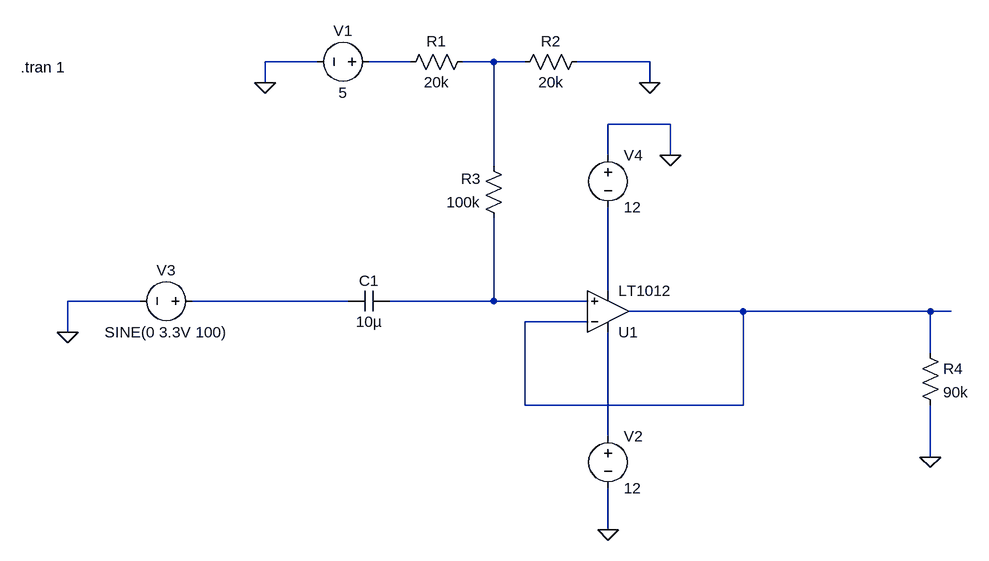
[diagram p0: schematic AudioAmpDiffs.asc]
AudioAmpDiffs.asc, the LTspice schematic file:
Version 4.1
SHEET 1 880 836
WIRE -224 96 -304 96
WIRE -80 96 -144 96
WIRE 48 96 0 96
WIRE 96 96 48 96
WIRE 288 96 176 96
WIRE -304 128 -304 96
WIRE 288 128 288 96
WIRE 320 192 224 192
WIRE 224 240 224 192
WIRE 320 240 320 192
WIRE 48 256 48 96
WIRE 224 448 224 320
WIRE -496 464 -608 464
WIRE -176 464 -416 464
WIRE 48 464 48 336
WIRE 48 464 -112 464
WIRE 192 464 48 464
WIRE 432 480 256 480
WIRE 720 480 432 480
WIRE 752 480 720 480
WIRE 192 496 96 496
WIRE -608 512 -608 464
WIRE 720 544 720 480
WIRE 96 624 96 496
WIRE 432 624 432 480
WIRE 432 624 96 624
WIRE 224 672 224 512
WIRE 720 704 720 624
WIRE 224 816 224 752
FLAG -304 128 0
FLAG 288 128 0
FLAG -608 512 0
FLAG 720 704 0
FLAG 320 240 0
FLAG 224 816 0
SYMBOL voltage -128 96 R90
WINDOW 0 -32 56 VBottom 2
WINDOW 3 32 56 VTop 2
WINDOW 123 0 0 Left 0
WINDOW 39 0 0 Left 0
SYMATTR InstName V1
SYMATTR Value 5
SYMBOL res 16 80 R90
WINDOW 0 0 56 VBottom 2
WINDOW 3 32 56 VTop 2
SYMATTR InstName R1
SYMATTR Value 20k
SYMBOL res 192 80 R90
WINDOW 0 0 56 VBottom 2
WINDOW 3 32 56 VTop 2
SYMATTR InstName R2
SYMATTR Value 20k
SYMBOL res 64 352 R180
WINDOW 0 36 76 Left 2
WINDOW 3 36 40 Left 2
SYMATTR InstName R3
SYMATTR Value 100k
SYMBOL cap -112 448 R90
WINDOW 0 0 32 VBottom 2
WINDOW 3 32 32 VTop 2
SYMATTR InstName C1
SYMATTR Value 10µ
SYMBOL voltage 224 656 R0
WINDOW 123 0 0 Left 0
WINDOW 39 0 0 Left 0
SYMATTR InstName V2
SYMATTR Value 12
SYMBOL voltage -400 464 R90
WINDOW 0 -32 56 VBottom 2
WINDOW 3 32 56 VTop 2
WINDOW 123 0 0 Left 0
WINDOW 39 0 0 Left 0
SYMATTR InstName V3
SYMATTR Value SINE(0 3.3V 100)
SYMBOL OpAmps\\LT1012 224 544 M180
SYMATTR InstName U1
SYMBOL res 704 528 R0
SYMATTR InstName R4
SYMATTR Value 90k
SYMBOL voltage 224 224 R0
WINDOW 123 0 0 Left 0
WINDOW 39 0 0 Left 0
SYMATTR InstName V4
SYMATTR Value 12
TEXT -680 104 Left 2 !.tran 1

The netlist it stands for:
* AudioAmpDiffs.asc
V1 N001 0 5
R1 N002 N001 20k
R2 0 N002 20k
R3 N005 N002 100k
C1 N005 N004 10µ
V2 N007 0 12
V3 N004 0 SINE(0 3.3V 100)
X§U1 N005 N006 N007 N003 N006 LT1012  ; pins In+ In- V+ V- OUT
R4 N006 0 90k
V4 0 N003 12
.tran 1
.backanno
.end